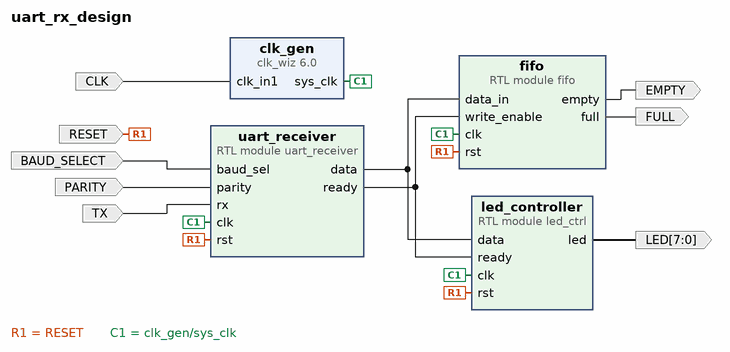
[diagram p0: block diagram of the top level]
# Vivado block design uart_rx_design, xc7a100tcsg324-1, Vivado 2023.1.1
create_bd_design uart_rx_design

create_bd_port -dir I -type rst RESET
set_property -dict {CONFIG.POLARITY ACTIVE_HIGH} [get_bd_ports RESET]
create_bd_port -dir I -type data BAUD_SELECT
create_bd_port -dir I -type data TX
create_bd_port -dir O -from 7 -to 0 -type data LED
create_bd_port -dir I -type clk CLK
set_property -dict {CONFIG.FREQ_HZ 100000000} [get_bd_ports CLK]
create_bd_port -dir I -type data PARITY
create_bd_port -dir O -type data EMPTY
create_bd_port -dir O -type data FULL

create_bd_cell -type ip -vlnv xilinx.com:ip:clk_wiz:6.0 clk_gen
set_property -dict [list \
  CONFIG.CLKIN1_JITTER_PS 100.000 \
  CONFIG.CLKIN1_UI_JITTER 100.000 \
  CONFIG.CLKIN2_JITTER_PS 100.000 \
  CONFIG.CLKIN2_UI_JITTER 100.000 \
  CONFIG.CLKOUT1_DRIVES BUFGCE \
  CONFIG.CLKOUT1_JITTER 116.394 \
  CONFIG.CLKOUT1_PHASE_ERROR 87.466 \
  CONFIG.CLKOUT1_REQUESTED_OUT_FREQ 100 \
  CONFIG.CLKOUT2_DRIVES BUFGCE \
  CONFIG.CLKOUT2_JITTER 123.670 \
  CONFIG.CLKOUT2_PHASE_ERROR 92.672 \
  CONFIG.CLKOUT2_REQUESTED_OUT_FREQ 9.8304 \
  CONFIG.CLKOUT2_USED false \
  CONFIG.CLKOUT3_DRIVES BUFGCE \
  CONFIG.CLKOUT3_JITTER 123.670 \
  CONFIG.CLKOUT3_PHASE_ERROR 92.672 \
  CONFIG.CLKOUT3_REQUESTED_OUT_FREQ 117.9648 \
  CONFIG.CLKOUT3_USED false \
  CONFIG.CLKOUT4_DRIVES BUFGCE \
  CONFIG.CLKOUT5_DRIVES BUFGCE \
  CONFIG.CLKOUT6_DRIVES BUFGCE \
  CONFIG.CLKOUT7_DRIVES BUFGCE \
  CONFIG.CLK_IN1_BOARD_INTERFACE sys_clock \
  CONFIG.CLK_IN2_BOARD_INTERFACE Custom \
  CONFIG.CLK_OUT1_PORT sys_clk \
  CONFIG.CLK_OUT2_PORT baud_1024x9600 \
  CONFIG.CLK_OUT3_PORT baud_1024x115200 \
  CONFIG.ENABLE_CLOCK_MONITOR false \
  CONFIG.FEEDBACK_SOURCE FDBK_AUTO \
  CONFIG.JITTER_OPTIONS PS \
  CONFIG.JITTER_SEL Min_O_Jitter \
  CONFIG.MMCM_BANDWIDTH HIGH \
  CONFIG.MMCM_CLKFBOUT_MULT_F 11.875 \
  CONFIG.MMCM_CLKOUT0_DIVIDE_F 11.875 \
  CONFIG.MMCM_CLKOUT1_DIVIDE 1 \
  CONFIG.MMCM_CLKOUT2_DIVIDE 1 \
  CONFIG.MMCM_COMPENSATION ZHOLD \
  CONFIG.MMCM_REF_JITTER2 0.010 \
  CONFIG.NUM_OUT_CLKS 1 \
  CONFIG.PRIMITIVE MMCM \
  CONFIG.RESET_BOARD_INTERFACE Custom \
  CONFIG.USE_BOARD_FLOW true \
  CONFIG.USE_CLOCK_SEQUENCING false \
  CONFIG.USE_DYN_PHASE_SHIFT false \
  CONFIG.USE_LOCKED false \
  CONFIG.USE_RESET false \
  CONFIG.USE_SAFE_CLOCK_STARTUP true \
] [get_bd_cells clk_gen]
create_bd_cell -type module -reference led_ctrl led_controller
create_bd_cell -type module -reference uart_receiver uart_receiver
create_bd_cell -type module -reference fifo fifo

# ---- connections ----

connect_bd_net [get_bd_ports BAUD_SELECT] [get_bd_pins uart_receiver/baud_sel]
connect_bd_net [get_bd_ports CLK] [get_bd_pins clk_gen/clk_in1]
connect_bd_net [get_bd_ports PARITY] [get_bd_pins uart_receiver/parity]
connect_bd_net [get_bd_ports RESET] [get_bd_pins led_controller/rst] [get_bd_pins uart_receiver/rst] [get_bd_pins fifo/rst]
connect_bd_net [get_bd_ports TX] [get_bd_pins uart_receiver/rx]
connect_bd_net [get_bd_pins clk_gen/sys_clk] [get_bd_pins led_controller/clk] [get_bd_pins uart_receiver/clk] [get_bd_pins fifo/clk]
connect_bd_net -net fifo_0_empty [get_bd_pins fifo/empty] [get_bd_ports EMPTY]
connect_bd_net -net fifo_0_full [get_bd_pins fifo/full] [get_bd_ports FULL]
connect_bd_net -net led_ctrl_0_led [get_bd_pins led_controller/led] [get_bd_ports LED]
connect_bd_net -net uart_receiver_0_data [get_bd_pins uart_receiver/data] [get_bd_pins led_controller/data] [get_bd_pins fifo/data_in]
connect_bd_net -net uart_receiver_0_ready [get_bd_pins uart_receiver/ready] [get_bd_pins led_controller/ready] [get_bd_pins fifo/write_enable]

validate_bd_design
save_bd_design
